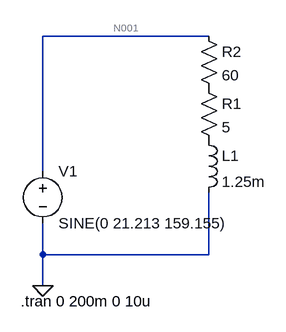
[diagram p0: schematic Схема5.asc]
Схема5.asc, the LTspice schematic file:
Version 4
SHEET 1 880 680
WIRE -1136 16 -1392 16
WIRE -1392 224 -1392 16
WIRE -1392 352 -1392 304
WIRE -1136 352 -1136 256
WIRE -1136 352 -1392 352
WIRE -1392 400 -1392 352
FLAG -1392 400 0
SYMBOL voltage -1392 208 R0
WINDOW 123 0 0 Left 0
WINDOW 39 0 0 Left 0
SYMATTR InstName V1
SYMATTR Value SINE(0 21.213 159.155)
SYMBOL res -1152 80 R0
SYMATTR InstName R1
SYMATTR Value 5
SYMBOL ind -1152 160 R0
SYMATTR InstName L1
SYMATTR Value 1.25m
SYMBOL res -1152 0 R0
SYMATTR InstName R2
SYMATTR Value 60
TEXT -1426 424 Left 2 !.tran 0 200m 0 10u

The netlist it stands for:
* Схема5.asc
V1 N001 0 SINE(0 21.213 159.155)
R1 P001 P002 5
L1 P002 0 1.25m
R2 N001 P001 60
.tran 0 200m 0 10u
.backanno
.end

* Results of the author's LTspice run, read from the files saved beside the schematic
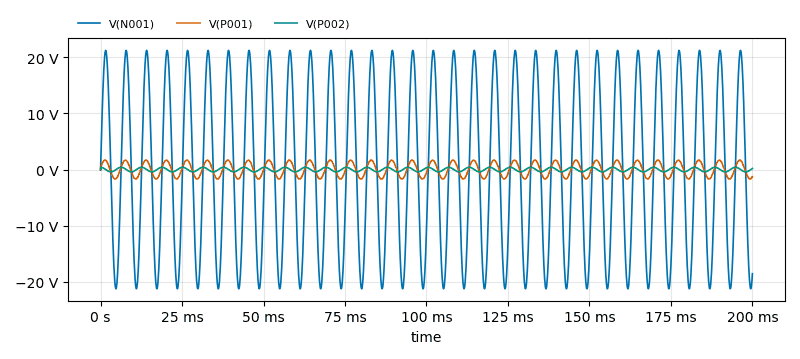
[diagram p1: Transient Analysis of Схема5.asc, plotted from the saved traces]
* Transient Analysis, 1 run:
*   V(N001): min -21.21 V, max 21.21 V, average 54.16 mV, rms 15.01 V, last -18.52 V
*   V(P001): min -1.682 V, max 1.681 V, average 2.508 mV, rms 1.19 V, last -1.248 V
*   V(P002): min -407.9 mV, max 407.9 mV, average -1.796 mV, rms 288.2 mV, last 191.6 mV